# Altium schematic sheet PCB_DYBoard_Feeder_V2.SchDoc
size A4; SheetNumber: 1; SheetTotal: 1
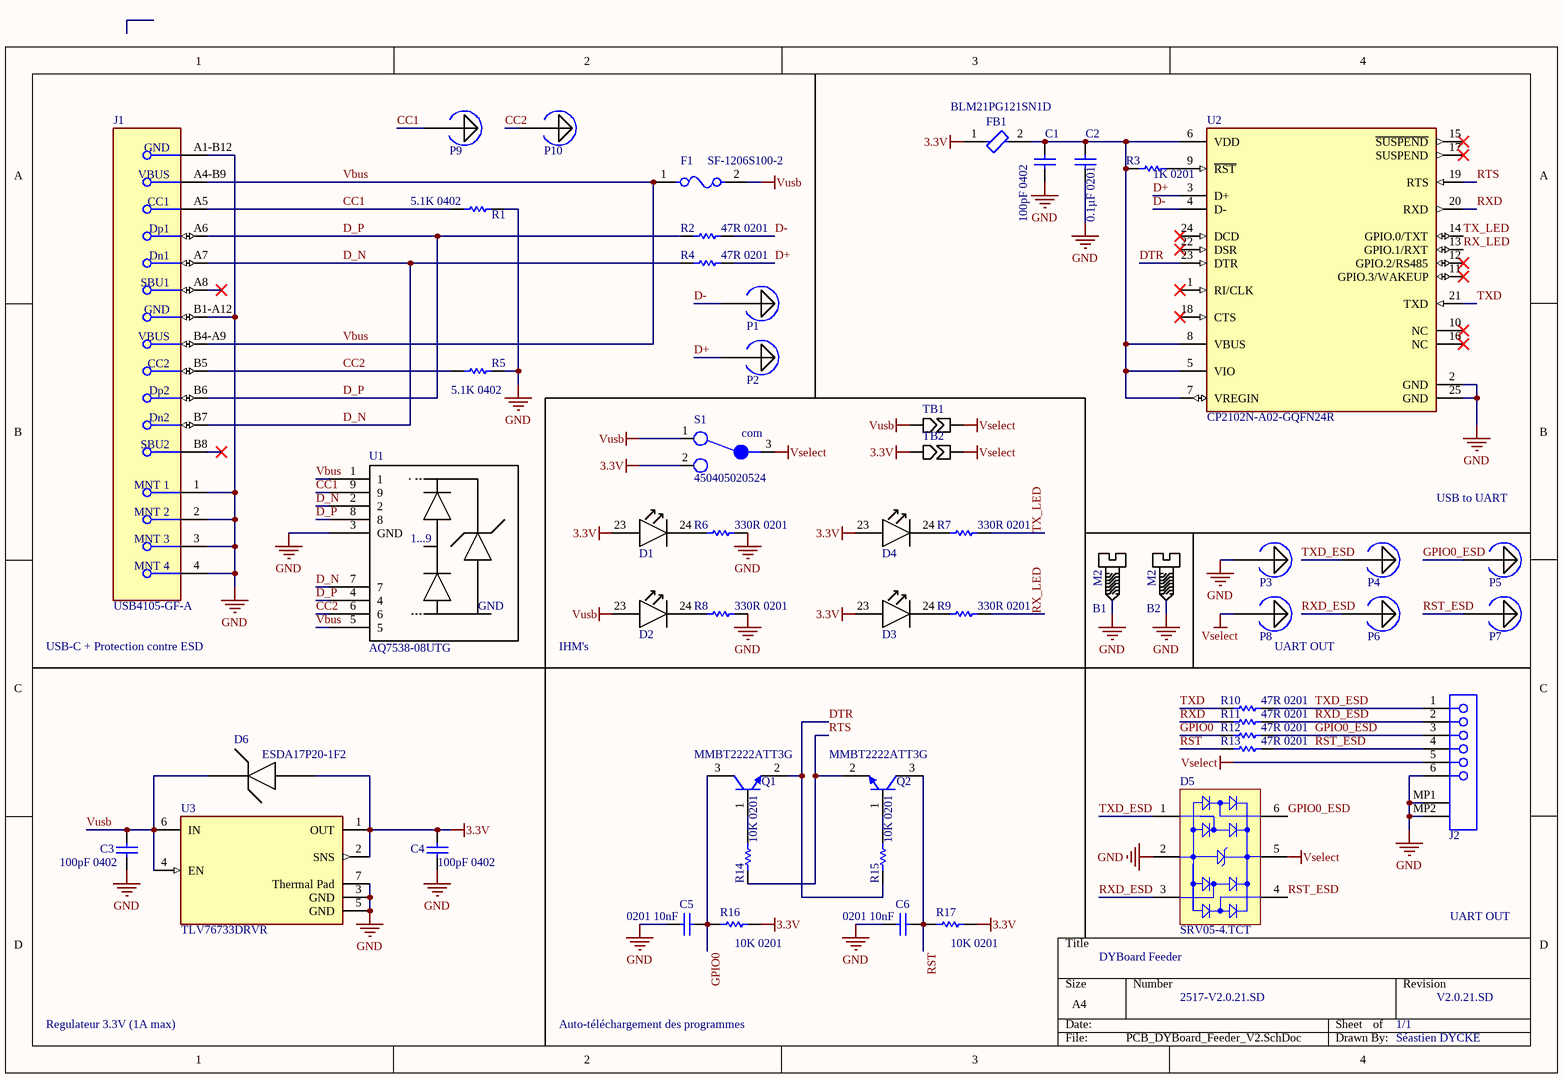
[diagram p0: PCB_DYBoard_Feeder_V2.SchDoc]

## Parts
B1  bolt_M2  [bolt_M2]  (value not drawn)
B2  bolt_M2  [bolt_M2]  (value not drawn)
C1  value 100pF 0402  [0402]  (hidden comment: Cap Semi)
C2  0.1µF 0201  [CAPC0603X33X15LL03T05]
C3  value 100pF 0402  [0402]  (hidden comment: Cap Semi)
C4  value 100pF 0402  [0402]  (hidden comment: Cap Semi)
C5  0201 10nF  [CAPC0603X33X15LL03T05]
C6  0201 10nF  [CAPC0603X33X15LL03T05]
D1  LED_0402  [LED_0402]  (value not drawn)
D2  LED_0402  [LED_0402]  (value not drawn)
D3  LED_0402  [LED_0402]  (value not drawn)
D4  LED_0402  [LED_0402]  (value not drawn)
D5  SRV05-4.TCT  [SMTC-SOT23-6_V]
D6  ESDA17P20-1F2  [ESDA17P20-1F2]
F1  SF-1206S100-2  [FP-SF-1206S-MFG]
FB1  BLM21PG121SN1D  [FP-BLM21-0_2-t0_85-e0_5-d-IPC_C]
J1  USB4105-GF-A  [FP-USB4105-GF-A-MFG]
J2  SEB_MOLeX_6p  [SEB_MOLeX_6p]  (value not drawn)
P1  solderPad  [solderPad_2]  (value not drawn)
P2  solderPad  [solderPad_2]  (value not drawn)
P3  solderPad  [solderPad_2]  (value not drawn)
P4  solderPad  [solderPad_2]  (value not drawn)
P5  solderPad  [solderPad_2]  (value not drawn)
P6  solderPad  [solderPad_2]  (value not drawn)
P7  solderPad  [solderPad_2]  (value not drawn)
P8  solderPad  [solderPad_2]  (value not drawn)
P9  solderPad  [solderPad_2]  (value not drawn)
P10  solderPad  [solderPad_2]  (value not drawn)
Q1  MMBT2222ATT3G  [ONSC-SC-75-3-463-01_V]
Q2  MMBT2222ATT3G  [ONSC-SC-75-3-463-01_V]
R1  5.1K 0402  [RESC1005X40X25NL05T10]
R2  47R 0201  [RESC0603X26X15ML03T05]
R3  1K 0201  [RESC0603X26X15ML03T05]
R4  47R 0201  [RESC0603X26X15ML03T05]
R5  5.1K 0402  [RESC1005X40X25NL05T10]
R6  330R 0201  [RESC0603X26X15ML03T05]
R7  330R 0201  [RESC0603X26X15ML03T05]
R8  330R 0201  [RESC0603X26X15ML03T05]
R9  330R 0201  [RESC0603X26X15ML03T05]
R10  47R 0201  [RESC0603X26X15ML03T05]
R11  47R 0201  [RESC0603X26X15ML03T05]
R12  47R 0201  [RESC0603X26X15ML03T05]
R13  47R 0201  [RESC0603X26X15ML03T05]
R14  10K 0201  [RESC0603X26X15ML03T05]
R15  10K 0201  [RESC0603X26X15ML03T05]
R16  10K 0201  [RESC0603X26X15ML03T05]
R17  10K 0201  [RESC0603X26X15ML03T05]
S1  450405020524  [450405020524]
TB1  tin_bridge  [tin_bridge]  (value not drawn)
TB2  tin_bridge  [tin_bridge]  (value not drawn)
U1  AQ7538-08UTG  [PCBComponent_1]
U2  CP2102N-A02-GQFN24R  [FP-CP2102N-A02-GQFN24R-MFG]
U3  TLV76733DRVR  [FP-DRV0006A-IPC_C]

## Nets
3.3V: C4.2 D1.23 D3.23 D4.23 D6.18(A) FB1.1 R16.2 R17.2 S1.2 TB2.21 U3.1(OUT) U3.2(SNS)
GND: B1.20 B2.20 C1.1 C2.1 C3.1 C4.1 C5.1 C6.1 D5.2(GND) J1.1(MNT_1) J1.2(MNT_2) J1.3(MNT_3) J1.4(MNT_4) J1.A1-B12(GND) J1.B1-A12(GND) J2.6 J2.MP1 J2.MP2 P3.20 R1.2 R5.2 R6.2 R8.2 U1.3(GND) U2.2(GND) U2.25(GND) U3.3(GND) U3.5(GND) U3.7(Thermal_Pad)
Vselect: D5.5(VBUS) J2.5 P8.20 S1.3 TB1.22 TB2.22
Vusb: C3.2 D2.23 D6.19(K) F1.2 S1.1 TB1.21 U3.4(EN) U3.6(IN)
CC1: J1.A5(CC1) P9.20 R1.1 U1.9
CC2: J1.B5(CC2) P10.20 R5.1 U1.6
D+: P2.20 R4.2 U2.3(D+)
D-: P1.20 R2.2 U2.4(D-)
D_N: J1.A7(Dn1) J1.B7(Dn2) R4.1 U1.2 U1.7
D_P: J1.A6(Dp1) J1.B6(Dp2) R2.1 U1.4 U1.8
DTR: Q1.2(E) R15.2 U2.23(DTR)
GPIO0: C5.2 Q1.3(C) R12.1 R16.1
GPIO0_ESD: D5.6(I/O_4) J2.3 P5.20 R12.2
RST: C6.2 Q2.3(C) R13.1 R17.1
RST_ESD: D5.4(I/O_3) J2.4 P7.20 R13.2
RTS: Q2.2(E) R14.2 U2.19(RTS)
RX_LED: R9.2 U2.13(GPIO.1/RXT)
RXD: R11.1 U2.20(RXD)
RXD_ESD: D5.3(I/O_2) J2.2 P6.20 R11.2
TX_LED: R7.2 U2.14(GPIO.0/TXT)
TXD: R10.1 U2.21(TXD)
TXD_ESD: D5.1(I/O_1) J2.1 P4.20 R10.2
Vbus: F1.1 J1.A4-B9(VBUS) J1.B4-A9(VBUS) U1.1 U1.5
NetC1_2: C1.2 C2.2 FB1.2 R3.1 U2.5(VIO) U2.6(VDD) U2.7(VREGIN) U2.8(VBUS)
NetD1_24: D1.24 R6.1
NetD2_24: D2.24 R8.1
NetD3_24: D3.24 R9.1
NetD4_24: D4.24 R7.1
NetQ1_1: Q1.1(B) R14.1
NetQ2_1: Q2.1(B) R15.1
NetR3_2: R3.2 U2.9(~{RST})

Not connected (* = marked no-connect by the designer): J1 A8(SBU1)* B8(SBU2)*; U2 1(RI/CLK)* 10(NC)* 11(GPIO.3/WAKEUP)* 12(GPIO.2/RS485)* 15(~{SUSPEND})* 16(NC)* 17(SUSPEND)* 18(CTS)* 22(DSR)* 24(DCD)*

## Notes on the sheet
- USB to UART
- USB-C + Protection contre ESD
- IHM's
- (near P8) UART OUT
- DYBoard Feeder
- UART OUT
- Regulateur 3.3V (1A max)
- Auto-téléchargement des programmes
- 2517-V2.0.21.SD
- 1/1
- V2.0.21.SD
- Séastien DYCKE
- (in symbol 450405020524) com
- (in symbol AQ7538-08UTG) 1...9
- (in symbol bolt_M2) M2

## Library data of the parts
C1 C3 C4 = Cap Semi: Capacitor (Semiconductor SIM Model); Published: 8-Jun-2000; LatestRevisionDate: 29-May-2009; LatestRevisionNote: IPC-7351 Footprint Added.; PackageReference: C1206; Publisher: Altium Limited; PackageDescription: Chip Capacitor
C2 C5 C6 = CMP-2010-00159-1: Part Number: 02016D104KAT2A; Manufacturer: AVX Interconnect / Elco
D5 = CMP-2000-05358-1: RailClamp(R) Low Capacitance TVS Diode Array, 5 pF, 17.5 VC, -55 to 125 degC, 6-Pin SOT23, RoHS, Tape and Reel; Manufacturer: Semtech; Leakage Current (Max): 5uA; Polarity: Uni-Directional; Peak Pulse Power Dissipation: 300W; Clamping Voltage: 17.5V; Number of Elements: 1; Working Voltage: 5V; Test Current (It): 1mA; Configuration: Quad; Reverse Breakdown Voltage: 6V; Suppressor Type: DiodeArrays; Peak Pulse Current: 12A; Product Depth (mm): 1.6mm; Product Height (mm): 1.15mm; Clamping Voltage (Max): 12.5V; Rad Hardened: No; Product Length (mm): 2.9mm; Capacitance Value: 5pF; Mounting: SurfaceMount; Datasheet URL: https://datasheet.ciiva.com/8029/srv05-4-8029973.pdf; Datasheet Version: Jan-08; Packaging: TapeandReel; Package / Case: SOT-23; Operating Temp Range: -55Cto125C; Pin Count: 6; Direction Type: Uni-Directional; Operating Temperature Min Deg. C: -55C; Reverse Stand-off Voltage: 5V; Leakage Current: 5uA; Manufacturer URL: http://www.semtech.com/; Working Voltage (Max): 5V; Package Reference: SOT23-6; Package Description: 6-Pin Small Outline Transistor, Body 2.9 x 1.6 mm, Pitch 0.95 mm; Operating Temperature Max Deg. C: 125C; Operating Temperature Classification: Military; Mounting Style: SurfaceMount
F1 = CMP-07399-000003-1: FUSE BOARD MOUNT 1A 63VDC 1206; Manufacturer: Bourns Inc.; Fuse I2T: 0.098A2Sec; Voltage Rating: 63V; Value: 132mΩ; Fuse Blow Speed: Slow; Fuse Interrupt Dc Current: 50A; Mouser Description: Surface Mount Fuses 1A Slow Blow SinglFuse; ComponentLink2Description: Datasheet; Height: 0.7mm; Manufacturer Part Number: SF-1206S100-2; Package: SF-1206S; Temperature: -20°C to +105°C; Resistance: 132mΩ; Category: Fuse; Temperature Range High: +105°C; Device Class L2: Fuses; Automotive: No; Temperature Range Low: -20°C; Octopart: https://octopart.com/sf-1206s100-2-bourns-8398337; Max Fuse Dc Voltage: 63V; Device Class L1: Circuit Protection; Device Class L3: unset; RoHS: TRUE; Digikey Description: FUSE BOARD MOUNT 1A 63VDC 1206; ComponentLink2URL: https://www.bourns.com/docs/Product-Datasheets/sf1206s.pdf; Lead Free: Yes; Fuse Current: 1A
FB1 = CMP-0686-00612-3: Chip Ferrite Bead, 0805, 120Ω @ 100MHz, 0.03Ω, 25%, 3A; Impedance: 120R; Number of Circuits: 1; Material: Steel; DC Resistance (DCR): 30mR; Package Quantity: 1; Lead Free: Lead Free; Width: 1.25mm; Number of Pins: 2; Depth: 1.25mm; Case Code (Imperial): 0805; Tolerance: 25%; Current Rating: 3A; Test Frequency: 100MHz; Length: 2mm; Min Operating Temperature: -55°C; Max Current Rating: 3A; REACH SVHC: No SVHC; Series: BLM21P; Height: 0.85mm; Max DC Current: 3A; Termination: SMD/SMT; Max Operating Temperature: 125°C; Number of Lines: 1; Case/Package: 0805; RoHS Compliant: Yes; Packaging: Tape and Reel; Case Code (Metric): 2012; DC Resistance-Max: 30mR
J1 = CMP-245163-000001-1: CONN RCPT USB2.0 TYPEC 5A; Manufacturer: GCT; Voltage Rating: 20V; Is Female: yes; Current Rating: 5/6.25/1.25/0.25A; Number Of Contacts: 16; Conn Orientation: Right Angle; Device Class L1: Connectors; Category: Conn; Lead Free: Yes; RoHS: TRUE; Temperature Range High: +85°C; Digikey Description: CONN RCPT USB2.0 TYPEC 5A; Device Class L3: unset; ComponentLink2Description: Datasheet; Manufacturer Part Number: USB4105-GF-A; Package: 0; Usb Standard: USB 2.0; Device Class L2: USB Connectors; Automotive: No; Temperature Range Low: -40°C; Height: 3.46mm; Temperature: -40°C to +85°C; Contact Material: Gold,Nickel; ComponentLink2URL: https://gct.co/files/drawings/usb4105.pdf; Octopart: https://octopart.com/usb4105-gf-a-gct-106627878
Q1 Q2 = CMP-1048-00416-1: General Purpose Transistor, NPN Silicon, 3-Pin SC-75, Pb-Free, Tape and Reel; Manufacturer: On Semiconductor; IC Continuous (A): 0.6; fT Min (MHz): 300; ComponentLink2URL: http://www.onsemi.cn/pub_link/Collateral/MMBT2222ATT1-D.PDF; ComponentLink2Description: Datasheet; ComponentLink1Description: Manufacturer URL; PartNumber: MMBT2222ATT3G; Mounting Technology: Surface Mount; RoHS: TRUE; ComponentLink1URL: http://www.onsemi.com/; PackageVersion: Rev. F, 07/2005; Polarity: NPN; PackageDescription: 3-Pin Small Outline Transistor, Body 1.6 x 0.8 mm, Pitch 0.5 mm; DatasheetVersion: Rev. 5; Packing: Tape and Reel; ComponentLink3Description: Package Specification; ComponentLink3URL: http://www.onsemi.com/pub_link/Collateral/463-01.PDF; PackageReference: SC-75-3-463-01
R1 R5 = CMP-2002-07472-1: Part Number: RC0402FR-071KL; Manufacturer: Yageo / Phycomp
R2-R4 R6-R17 = CMP-2004-03517-1: Manufacturer: Panasonic; Part Number: ERJ1GNF47R0C
S1 = 450405020524: SMT 8.7 X 3.0 MM MINI SLIDE SWIT; MF: WÃ¼rth Elektronik; Availability: Warning; Value: *; Check_prices: https://www.snapeda.com/parts/450405020524/Wurth%20Electronics%20Inc./view-part/4900805/?ref=eda; Package: None; SnapEDA_Link: https://www.snapeda.com/parts/450405020524/Wurth%20Electronics%20Inc./view-part/4900805/?ref=snap; Price: None; MP: 450405020524; Purchase-URL: https://pricing.snapeda.com/search/part/450405020524/?ref=eda
U2 = CMP-08107-000009-1: IC USB TO UART BRIDGE QFN24
U3 = CMP-04917-000203-1: VOLTAGE COMPARATOR